# EAGLE design buoy (EAGLE 7.7.0)
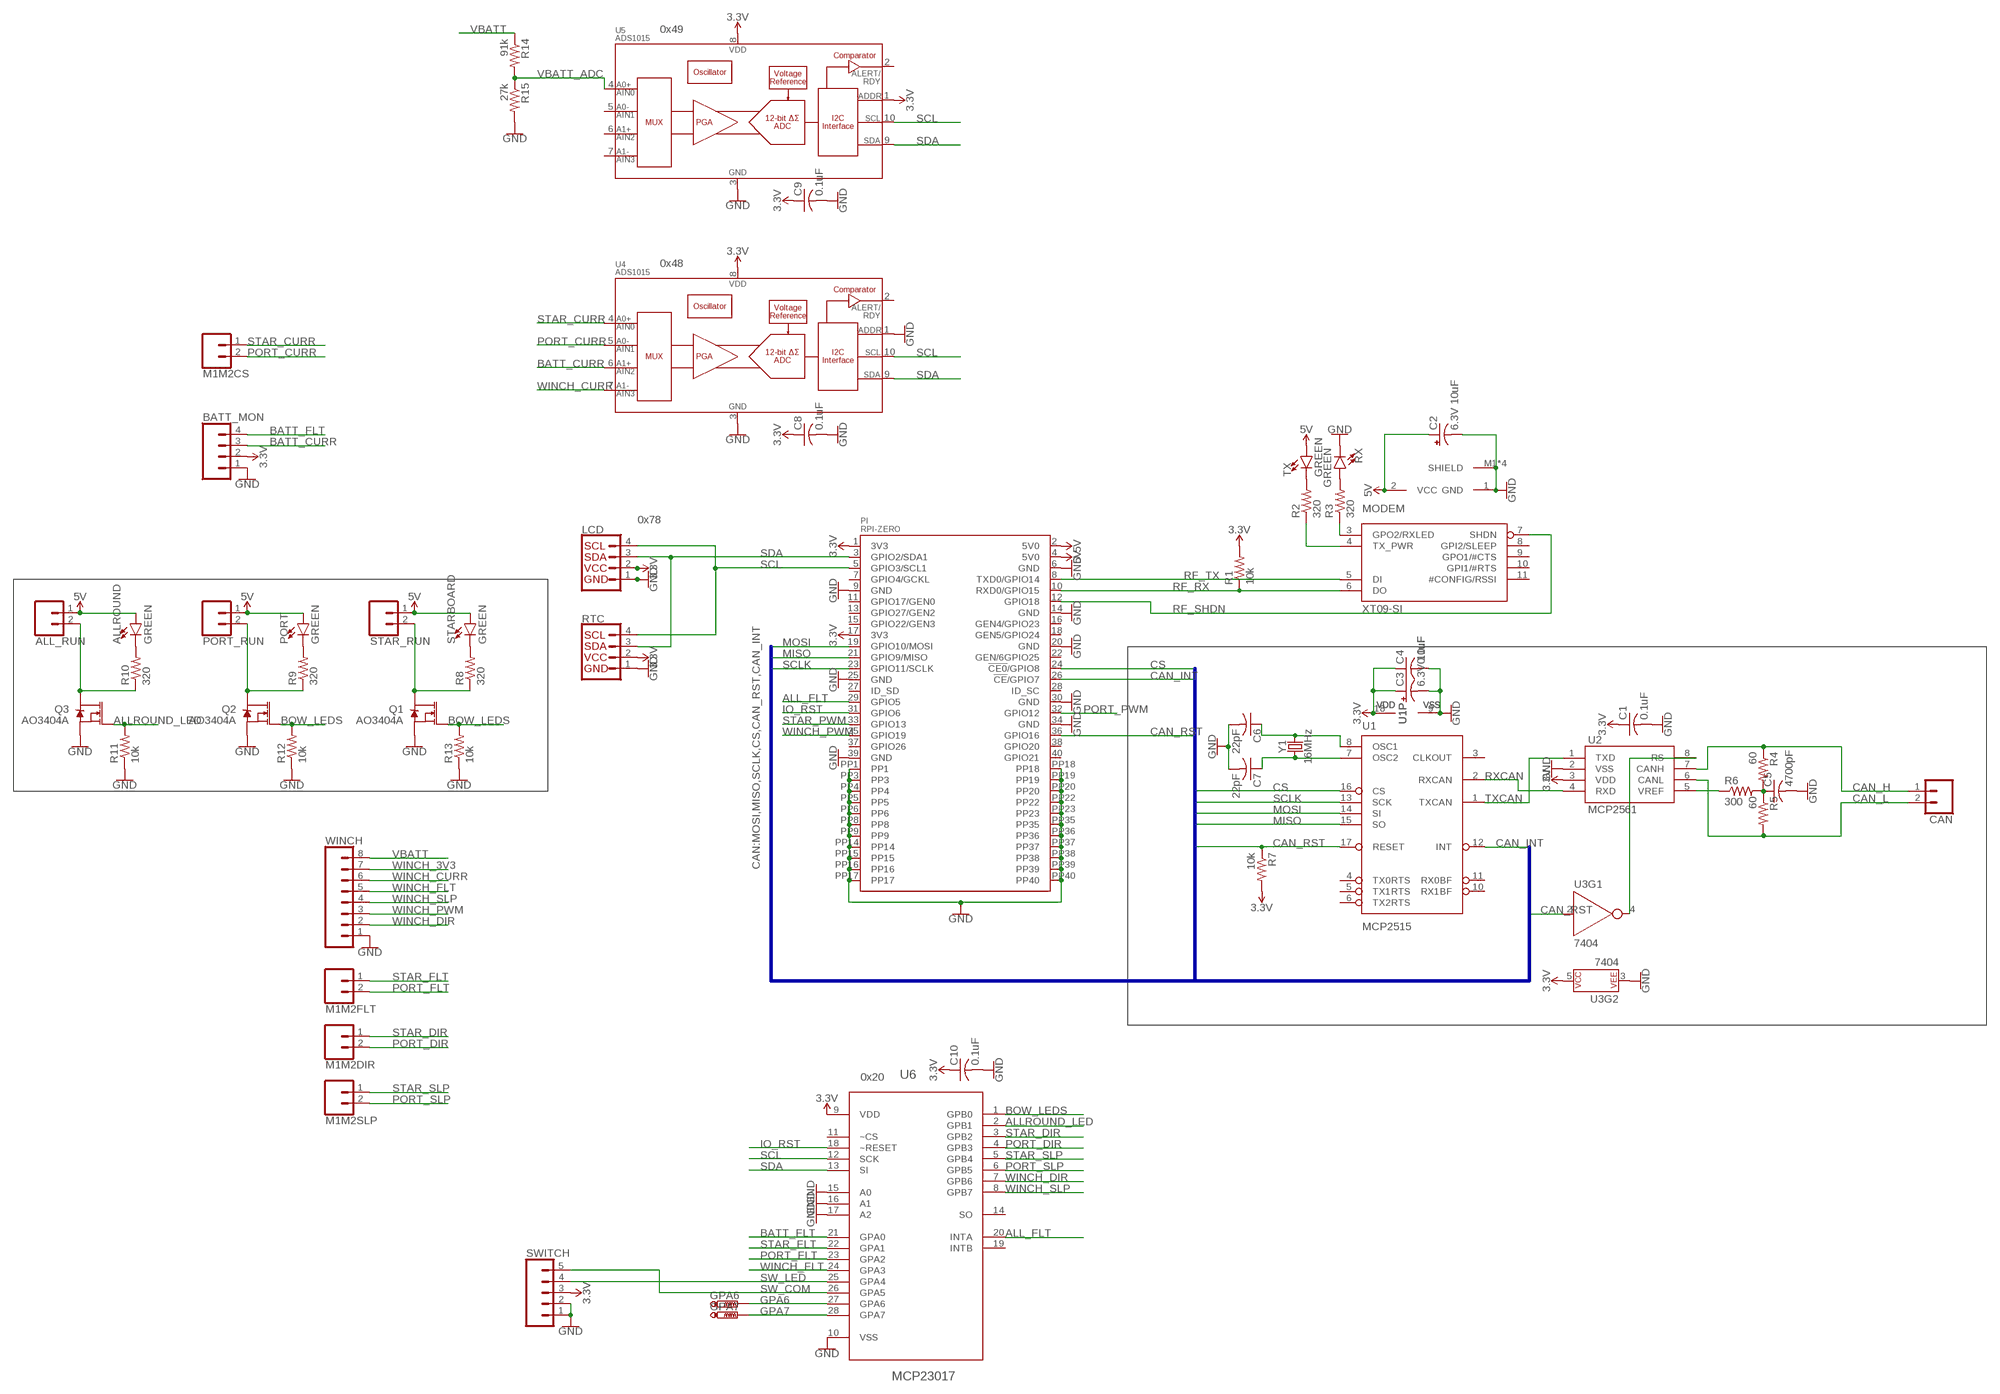
[diagram p0: schematic, sheet 1]

## Parts
ALL_RUN  CONN_02JST-PTH-2  [JST-2-PTH]
ALLROUND  GREEN  LED-GREEN1206  [LED-1206]
BATT_MON  CONN_04LOCK  [1X04_LOCK]
C1  0.1uF  C-USC1206  [C1206]
C2  6.3V 10uF  CPOL-US153CLV-0405  [153CLV-0405]
C3  6.3V 10uF  CPOL-US153CLV-0405  [153CLV-0405]
C4  0.1uF  C-USC1206  [C1206]
C5  4700pF  C-USC1206  [C1206]
C6  22pF  C-USC1206  [C1206]
C7  22pF  C-USC1206  [C1206]
C8  0.1uF  C-USC1206  [C1206]
C9  0.1uF  C-USC1206  [C1206]
C10  0.1uF  C-USC1206  [C1206]
CAN  CONN_02JST-PTH-2  [JST-2-PTH]
GPA6  PTR1B1,27  [B1,27]
GPA7  PTR1B1,27  [B1,27]
LCD  I2C_STANDARD  [1X04]
M1M2CS  CONN_02JST-PTH-2  [JST-2-PTH]
M1M2DIR  CONN_02JST-PTH-2  [JST-2-PTH]
M1M2FLT  CONN_02JST-PTH-2  [JST-2-PTH]
M1M2SLP  CONN_02JST-PTH-2  [JST-2-PTH]
MODEM  XT09-SI  [XT09-SI]
PI  RPI-ZERO  [RASP_PI_ZERO_BOARD_FULL]
PORT  GREEN  LED-GREEN1206  [LED-1206]
PORT_RUN  CONN_02JST-PTH-2  [JST-2-PTH]
Q1  AO3404A  MOSFET-NCH-AO3404A  [SOT23-3]
Q2  AO3404A  MOSFET-NCH-AO3404A  [SOT23-3]
Q3  AO3404A  MOSFET-NCH-AO3404A  [SOT23-3]
R1  10k  R-US_R1206  [R1206]
R2  320  R-US_R1206  [R1206]
R3  320  R-US_R1206  [R1206]
R4  60  R-US_R1206  [R1206]
R5  60  R-US_R1206  [R1206]
R6  300  R-US_R1206  [R1206]
R7  10k  R-US_R1206  [R1206]
R8  320  R-US_R1206  [R1206]
R9  320  R-US_R1206  [R1206]
R10  320  R-US_R1206  [R1206]
R11  10k  R-US_R1206  [R1206]
R12  10k  R-US_R1206  [R1206]
R13  10k  R-US_R1206  [R1206]
R14  91k  R-US_R1206  [R1206]
R15  27k  R-US_R1206  [R1206]
RTC  I2C_STANDARD  [1X04]
RX  GREEN  LED-GREEN1206  [LED-1206]
STAR_RUN  CONN_02JST-PTH-2  [JST-2-PTH]
STARBOARD  GREEN  LED-GREEN1206  [LED-1206]
SWITCH  CONN_05LOCK  [1X05_LOCK]
TX  GREEN  LED-GREEN1206  [LED-1206]
U1  MCP2515  MCP2515(MCP2510)SO  [SO18W]
U2  MCP2561  MCP2551  [SO08]
U3  7404  74LVC1G04SE  [SOT353]
U4  ADS1015  [MSOP10]
U5  ADS1015  [MSOP10]
U6  MCP23017  MCP23S17-E/SO  [SOIC127P030X265-28N]
WINCH  CONN_08LOCK  [1X08_LOCK]
Y1  16MHz  CRYSTAL-16MHZPTH-HC49US  [HC49US]

## Nets
3.3V: BATT_MON.2 C1.1 C3.+ C4.1 C8.1 C9.1 C10.1 LCD.2 PI.1(3V3) PI.17(3V3) R1.2 R7.2 RTC.2 SWITCH.3 U1.18(VDD) U2.3(VDD) U3.5(P$V+) U4.8(VDD) U5.1(ADDR) U5.8(VDD) U6.9(VDD)
5V: ALL_RUN.1 ALLROUND.A C2.+ MODEM.2(VCC) PI.2(5V0) PI.4(5V0) PORT.A PORT_RUN.1 STAR_RUN.1 STARBOARD.A TX.A
#CAN_RST: U2.8(RS) U3.4(Y)
ALL_FLT: PI.29(GPIO5) U6.20(INTA)
ALLROUND_IND: ALLROUND.C R10.2
ALLROUND_LED: Q3.1(G) R11.2 U6.2(GPB1)
ALLROUND_LED_LSD: ALL_RUN.2 Q3.3(D) R10.1
BATT_CURR: BATT_MON.3 U4.6(AIN2)
BATT_FLT: BATT_MON.4 U6.21(GPA0)
BOW_LEDS: Q1.1(G) Q2.1(G) R12.2 R13.2 U6.1(GPB0)
CAN_H: CAN.1 R4.1 U2.7(CANH)
CAN_INT: PI.26(!CE!/GPIO7) U1.12(INT)
CAN_L: CAN.2 R5.2 U2.6(CANL)
CAN_RST: PI.36(GPIO16) R7.1 U1.17(RESET) U3.2(A)
CAN_TERM: C5.1 R4.2 R5.1 R6.2
CAN_VREF: R6.1 U2.5(VREF)
CS: PI.24(!CE0!/GPIO8) U1.16(CS)
GND: BATT_MON.1 C1.2 C2.- C3.- C4.2 C5.2 C6.2 C7.2 C8.2 C9.2 C10.2 LCD.1 MODEM.1(GND) MODEM.M1(SHIELD) MODEM.M2(SHIELD) MODEM.M3(SHIELD) MODEM.M4(SHIELD) PI.6(GND) PI.9(GND) PI.14(GND) PI.20(GND) PI.25(GND) PI.30(GND) PI.34(GND) PI.39(GND) PI.PP1 PI.PP3 PI.PP4 PI.PP5 PI.PP6 PI.PP8 PI.PP9 PI.PP14 PI.PP15 PI.PP16 PI.PP17 PI.PP18 PI.PP19 PI.PP20 PI.PP22 PI.PP23 PI.PP35 PI.PP36 PI.PP37 PI.PP38 PI.PP39 PI.PP40 Q1.2(S) Q2.2(S) Q3.2(S) R11.1 R12.1 R13.1 R15.2 RTC.1 RX.C SWITCH.1 SWITCH.2 U1.9(VSS) U2.2(VSS) U3.3(P$V-) U4.1(ADDR) U4.3(VSS) U5.3(VSS) U6.10(VSS) U6.15(A0) U6.16(A1) U6.17(A2) WINCH.1
GPA6: GPA6.TP U6.27(GPA6)
GPA7: GPA7.TP U6.28(GPA7)
IO_RST: PI.31(GPIO6) U6.18(~RESET)
MISO: PI.21(GPIO9/MISO) U1.15(SO)
MOSI: PI.19(GPIO10/MOSI) U1.14(SI)
OSC1: C6.1 U1.8(OSC1) Y1.2
OSC2: C7.1 U1.7(OSC2) Y1.1
PORT_CURR: M1M2CS.2 U4.5(AIN1)
PORT_DIR: M1M2DIR.2 U6.4(GPB3)
PORT_FLT: M1M2FLT.2 U6.23(GPA2)
PORT_IND: PORT.C R9.2
PORT_LED_LSD: PORT_RUN.2 Q2.3(D) R9.1
PORT_PWM: PI.32(GPIO12)
PORT_SLP: M1M2SLP.2 U6.6(GPB5)
RF_RX: MODEM.6(DO) PI.10(RXD0/GPIO15) R1.1
RF_SHDN: MODEM.7(SHDN) PI.12(GPIO18)
RF_TX: MODEM.5(DI) PI.8(TXD0/GPIO14)
RXCAN: U1.2(RXCAN) U2.4(RXD)
RXLED: MODEM.3(GPO2/RXLED) R3.1
RXLED_L: R3.2 RX.A
SCL: LCD.4 PI.5(GPIO3/SCL1) RTC.4 U4.10(SCL) U5.10(SCL) U6.12(SCK)
SCLK: PI.23(GPIO11/SCLK) U1.13(SCK)
SDA: LCD.3 PI.3(GPIO2/SDA1) RTC.3 U4.9(SDA) U5.9(SDA) U6.13(SI)
STAR_CURR: M1M2CS.1 U4.4(AIN0)
STAR_DIR: M1M2DIR.1 U6.3(GPB2)
STAR_FLT: M1M2FLT.1 U6.22(GPA1)
STAR_IND: R8.2 STARBOARD.C
STAR_PWM: PI.33(GPIO13)
STAR_SLP: M1M2SLP.1 U6.5(GPB4)
STARBOARD_LED_LSD: Q1.3(D) R8.1 STAR_RUN.2
SW_COM: SWITCH.5 U6.26(GPA5)
SW_LED: SWITCH.4 U6.25(GPA4)
TX_PWR: MODEM.4(TX_PWR) R2.1
TX_PWR_L: R2.2 TX.C
TXCAN: U1.1(TXCAN) U2.1(TXD)
VBATT: R14.1 WINCH.8
VBATT_ADC: R14.2 R15.1 U5.4(AIN0)
WINCH_3V3: WINCH.7
WINCH_CURR: U4.7(AIN3) WINCH.6
WINCH_DIR: U6.7(GPB6) WINCH.2
WINCH_FLT: U6.24(GPA3) WINCH.5
WINCH_PWM: PI.35(GPIO19) WINCH.3
WINCH_SLP: U6.8(GPB7) WINCH.4
Unconnected: MODEM.8(GPI2/SLEEP) MODEM.9(GPO1/#CTS) MODEM.10(GPI1/#RTS) MODEM.11(#CONFIG/RSSI) PI.7(GPIO4/GCKL) PI.11(GPIO17/GEN0) PI.13(GPIO27/GEN2) PI.15(GPIO22/GEN3) PI.16(GEN4/GPIO23) PI.18(GEN5/GPIO24) PI.22(GEN/6GPIO25) PI.27(ID_SD) PI.28(ID_SC) PI.37(GPIO26) PI.38(GPIO20) PI.40(GPIO21) U1.3(CLKOUT) U1.4(TX0RTS) U1.5(TX1RTS) U1.6(TX2RTS) U1.10(RX1BF) U1.11(RX0BF) U4.2(ALERT/RDY) U5.2(ALERT/RDY) U5.5(AIN1) U5.6(AIN2) U5.7(AIN3) U6.11(~CS) U6.14(SO) U6.19(INTB)

## Buses
CAN:MOSI,MISO,SCLK,CS,CAN_RST,CAN_INT

## Notes on the sheet
- 0x49
- 0x48
- 0x78
- 0x20

## Library data of the parts
ALL_RUN CAN M1M2CS M1M2DIR M1M2FLT M1M2SLP PORT_RUN STAR_RUN = SparkFun-Connectors:CONN_02: Multi connection point. Often used as Generic Header-pin footprint for 0.1 inch spaced/style header connections On any of the 0.1 inch spaced packages, you can populate with these: Break Away Headers - Straight <https://www.sparkfun.com/products/116> (PRT-00116) Break Away Male Headers - Right Angle <https://www.sparkfun.com/products/553> (PRT-00553) Female Headers <https://www.sparkfun.com/products/115> (PRT-00115) Break Away Headers - Machine Pin <https://www.sparkfun.com/products/117> (PRT-00117) Break Away Female Headers - Swiss Machine Pin <https://www.sparkfun.com/products/743> (PRT-00743) For SCREWTERMINALS and SPRING TERMINALS visit here: Screw Terimnals on SparkFun.com <https://www.sparkfun.com/search/results?term=Screw+Terminals> (5mm/3.5mm/2.54mm spacing) This device is also useful as a general connection point to wire up your design to another part of your project. Our various solder wires solder well into these plated through hole pads. Hook-Up Wire - Assortment (Stranded, 22 AWG) <https://www.sparkfun.com/products/11375> (PRT-11375) Hook-Up Wire - Assortment (Solid Core, 22 AWG) <https://www.sparkfun.com/products/11367> (PRT-11367) View the entire wire category on our website here <https://www.sparkfun.com/categories/141> Special notes: Molex polarized connector foot print use with: PRT-08233 with associated crimp pins and housings. 2.54_SCREWTERM for use with PRT-10571. 3.5mm Screw Terminal footprints for PRT-08084 5mm Screw Terminal footprints for use with PRT-08432; PROD_ID: CONN-09863; SKU: PRT-09914
ALLROUND PORT RX STARBOARD TX = SparkFun-LED:LED-GREEN: Green SMD LED Used in manufacturing of various products at SparkFun Packages: 0603 - SMD 0603 package [Product Link] <http://www.futureelectronics.com/en/technologies/semiconductors/optoelectronics/leds/Pages/9894312-LTST-C190GKT.aspx?CrossPart=HSMG-C190&IM=0> LilyPad 1206 - SMD1206 LilyPad package [Product Link] <http://www.futureelectronics.com/en/Technologies/Product.aspx?ProductID=IN150NGHARVATEKCORPORATION2049943&IM=0> 1206 - SMD1206 package [Product Link] <http://www.futureelectronics.com/en/technologies/semiconductors/optoelectronics/leds/Pages/8315665-LTST-C150KGKT.aspx?IM=0> 1206 Bottom Mount -SMD 1206 Bottom Mount [Product Link] <http://www.digikey.com/product-detail/en/lite-on-inc/LTST-C230KGKT/160-1456-1-ND/386854> SparkFun Products: Pro Mini 328 -5V <https://www.sparkfun.com/products/821> RedBoard <https://www.sparkfun.com/products/12757> MP3 Trigger <https://www.sparkfun.com/products/13720> Makey Makey <https://www.sparkfun.com/products/11076>; PROD_ID: DIO-00862
BATT_MON = SparkFun-Connectors:CONN_04: Multi connection point. Often used as Generic Header-pin footprint for 0.1 inch spaced/style header connections On any of the 0.1 inch spaced packages, you can populate with these: Break Away Headers - Straight <https://www.sparkfun.com/products/116> (PRT-00116) Break Away Male Headers - Right Angle <https://www.sparkfun.com/products/553> (PRT-00553) Female Headers <https://www.sparkfun.com/products/115> (PRT-00115) Break Away Headers - Machine Pin <https://www.sparkfun.com/products/117> (PRT-00117) Break Away Female Headers - Swiss Machine Pin <https://www.sparkfun.com/products/743> (PRT-00743) For SCREWTERMINALS and SPRING TERMINALS visit here: Screw Terimnals on SparkFun.com <https://www.sparkfun.com/search/results?term=Screw+Terminals> (5mm/3.5mm/2.54mm spacing) This device is also useful as a general connection point to wire up your design to another part of your project. Our various solder wires solder well into these plated through hole pads. Hook-Up Wire - Assortment (Stranded, 22 AWG) <https://www.sparkfun.com/products/11375> (PRT-11375) Hook-Up Wire - Assortment (Solid Core, 22 AWG) <https://www.sparkfun.com/products/11367> (PRT-11367) View the entire wire category on our website here <https://www.sparkfun.com/categories/141> Special notes: Molex polarized connector foot print use with SKU : PRT-08231 with associated crimp pins and housings. 1MM SMD Version SKU: PRT-10208; PROD_ID: CONN-09696
C1 C4-C10 = rcl:C-US: CAPACITOR, American symbol
C2 C3 = rcl:CPOL-US: POLARIZED CAPACITOR, American symbol
GPA6 GPA7 = testpad:PTR1: TEST PIN
LCD RTC = SparkFun-Connectors:I2C_STANDARD: SparkFun I2C Standard Pinout Header SparkFun has standardized on a pinout for all I2C based sensor breakouts. This pinout allows I2C boards to be plugged directly into the headers on Arduino Uno compatible boards, and to be daisy chained easily. Example SparkFun Products: SparkFun Atmospheric Sensor Breakout - BME280 <https://www.sparkfun.com/products/13676> SparkFun Altitude/Pressure Sensor Breakout - MPL3115A2 <https://www.sparkfun.com/products/11084> SparkFun TOF Range Finder Sensor - VL6180 <https://www.sparkfun.com/products/12785>
MODEM = autobuoy:XT09-SI: Digi MaxStream 9XTend 900MHz OEM Module XT09-SI, with low-profile SMT header
PI = rpi-zero:RPI-ZERO
Q1-Q3 = SparkFun-DiscreteSemi:MOSFET-NCH: N-channel MOSFETs Voltage controlled devices that allow control of high current outputs. SparkFun Products: SparkFun OpenScale <https://www.sparkfun.com/products/13261> SparkFun Digital Sandbox <https://www.sparkfun.com/products/12651> SparkFun Monster Moto Shield <https://www.sparkfun.com/products/10182> SparkFun MOSFET Power Controller <https://www.sparkfun.com/products/11214>; PROD_ID: TRANS-12988; VALUE: 5.8A/30V/35mΩ
R1-R15 = rcl:R-US_: RESISTOR, American symbol
SWITCH = SparkFun-Connectors:CONN_05: Multi connection point. Often used as Generic Header-pin footprint for 0.1 inch spaced/style header connections On any of the 0.1 inch spaced packages, you can populate with these: Break Away Headers - Straight <https://www.sparkfun.com/products/116> (PRT-00116) Break Away Male Headers - Right Angle <https://www.sparkfun.com/products/553> (PRT-00553) Female Headers <https://www.sparkfun.com/products/115> (PRT-00115) Break Away Headers - Machine Pin <https://www.sparkfun.com/products/117> (PRT-00117) Break Away Female Headers - Swiss Machine Pin <https://www.sparkfun.com/products/743> (PRT-00743) For SCREWTERMINALS and SPRING TERMINALS visit here: Screw Terimnals on SparkFun.com <https://www.sparkfun.com/search/results?term=Screw+Terminals> (5mm/3.5mm/2.54mm spacing) This device is also useful as a general connection point to wire up your design to another part of your project. Our various solder wires solder well into these plated through hole pads. Hook-Up Wire - Assortment (Stranded, 22 AWG) <https://www.sparkfun.com/products/11375> (PRT-11375) Hook-Up Wire - Assortment (Solid Core, 22 AWG) <https://www.sparkfun.com/products/11367> (PRT-11367) View the entire wire category on our website here <https://www.sparkfun.com/categories/141> Special notes: Molex polarized connector foot print use with SKU : PRT-08231 with associated crimp pins and housings. 1MM SMD Version SKU: PRT-10208
U1 = SparkFun-IC-Comms:MCP2515(MCP2510): CAN controller with SPI interface The MCP2515 controller supercedes the MCP2510 while addressing all errata associated with it. The two devices are pin compatible, either can be used with this device. 18-pin package SOIC Simple SPI interface to any MCU. One-shot mode ensures message transmission is attempted only once Databyte filtering Start-of-Frame (SOF) output Low-power CMOS Technology Datasheet <http://www.sparkfun.com/datasheets/DevTools/Arduino/MCP2515.pdf> SparkFun Products CAN-BUS Shield <https://www.sparkfun.com/products/13262> (DEV-13262); PROD_ID: IC-09906
U2 = SparkFun-IC-Comms:MCP2551: MCP2551 High Speed CAN Transceiver High speed CAN transceiver Datasheet <http://www.sparkfun.com/datasheets/DevTools/Arduino/MCP2551.pdf> SparkFun Products CAN-BUS Shield <https://www.sparkfun.com/products/13262> (DEV-13262) SparkFun OBD-II UART <https://www.sparkfun.com/products/9555> (WIG-09555); PROD_ID: IC-09907; VALUE: MCP2551
U3 = SparkFun-IC-Logic:74*1G04: Single Inverter IC NOT GATE INVERTER SNGL 1IN SOT353 Supply: 1.65V to 5.5V Datasheet <http://diodes.com/datasheets/74LVC1G04.pdf> SparkFun Products SparkFun Stepoko <https://www.sparkfun.com/products/13899> (ROB-13899) SparkFun CryptoShield <https://www.sparkfun.com/products/13183> (DEV-13183) SparkFun LogicBlocks Kit <https://www.sparkfun.com/products/11006> (KIT-11006) SparkFun ArduMoto <https://www.sparkfun.com/products/9815> (DEV-09815); PROD_ID: IC-10843; VALUE: 74LVC1G04SE
U4 U5 = SparkFun-IC-Conversion:ADS1015: ADS1015 12-BIT ADC 12-Bit Del-Sig ADC Four single-ended inputs or two differential inputs Internal PGA I2C interface 2.0-5.5V SparkFun Products SparkFun Block for Intel Edison - ADC <https://www.sparkfun.com/products/13770> (DEV-13770); PROD_ID: IC-12270
U6 = Microchip_By_element14_Batch_1:MCP23S17-E/SO: 16-Bit I/O Expander; DESCRIPTION: IC I/O EXPANDER; MPN: MCP23S17-E/SO; OC_FARNELL: 1332093; OC_NEWARK: 31K2950; PACKAGE: SOIC-28; SUPPLIER: Microchip
WINCH = SparkFun-Connectors:CONN_08: Multi connection point. Often used as Generic Header-pin footprint for 0.1 inch spaced/style header connections On any of the 0.1 inch spaced packages, you can populate with these: Break Away Headers - Straight <https://www.sparkfun.com/products/116> (PRT-00116) Break Away Male Headers - Right Angle <https://www.sparkfun.com/products/553> (PRT-00553) Female Headers <https://www.sparkfun.com/products/115> (PRT-00115) Break Away Headers - Machine Pin <https://www.sparkfun.com/products/117> (PRT-00117) Break Away Female Headers - Swiss Machine Pin <https://www.sparkfun.com/products/743> (PRT-00743) Arduino Stackable Header - 8 Pin <https://www.sparkfun.com/products/9279> (PRT-09279) For SCREWTERMINALS and SPRING TERMINALS visit here: Screw Terimnals on SparkFun.com <https://www.sparkfun.com/search/results?term=Screw+Terminals> (5mm/3.5mm/2.54mm spacing) This device is also useful as a general connection point to wire up your design to another part of your project. Our various solder wires solder well into these plated through hole pads. Hook-Up Wire - Assortment (Stranded, 22 AWG) <https://www.sparkfun.com/products/11375> (PRT-11375) Hook-Up Wire - Assortment (Solid Core, 22 AWG) <https://www.sparkfun.com/products/11367> (PRT-11367) View the entire wire category on our website here <https://www.sparkfun.com/categories/141> Special notes: Molex polarized connector foot print use with SKU : PRT-08231 with associated crimp pins and housings. 1MM SMD Version SKU: PRT-10208 NOTES ON THE VARIANTS LOCK and LOCK_LONGPADS... This footprint was designed to help hold the alignment of a through-hole component (i.e. 6-pin header) while soldering it into place. You may notice that each hole has been shifted either up or down by 0.005 of an inch from it's more standard position (which is a perfectly straight line). This slight alteration caused the pins (the squares in the middle) to touch the edges of the holes. Because they are alternating, it causes a "brace" to hold the component in place. 0.005 has proven to be the perfect amount of "off-center" position when using our standard breakaway headers. Although looks a little odd when you look at the bare footprint, once you have a header in there, the alteration is very hard to notice. Also,if you push a header all the way into place, it is covered up entirely on the bottom side.
Y1 = SparkFun-Clocks:CRYSTAL-16MHZ: 16MHz Crystal Digikey Example <http://www.digikey.com/product-search/en?keywords=535-9122-1-ND> Frequency: 16MHz Frequency Stability: ±50ppm Frequency Tolerance: ±20ppm Load Capacitance: 18pF SparkFun Products: Pro Micro -5V/16MHz <https://www.sparkfun.com/products/12640> SparkFun Serial Enabled LCD Kit <https://www.sparkfun.com/products/10097>; PROD_ID: XTAL-08181; SF_ID: COM-00536

## Board
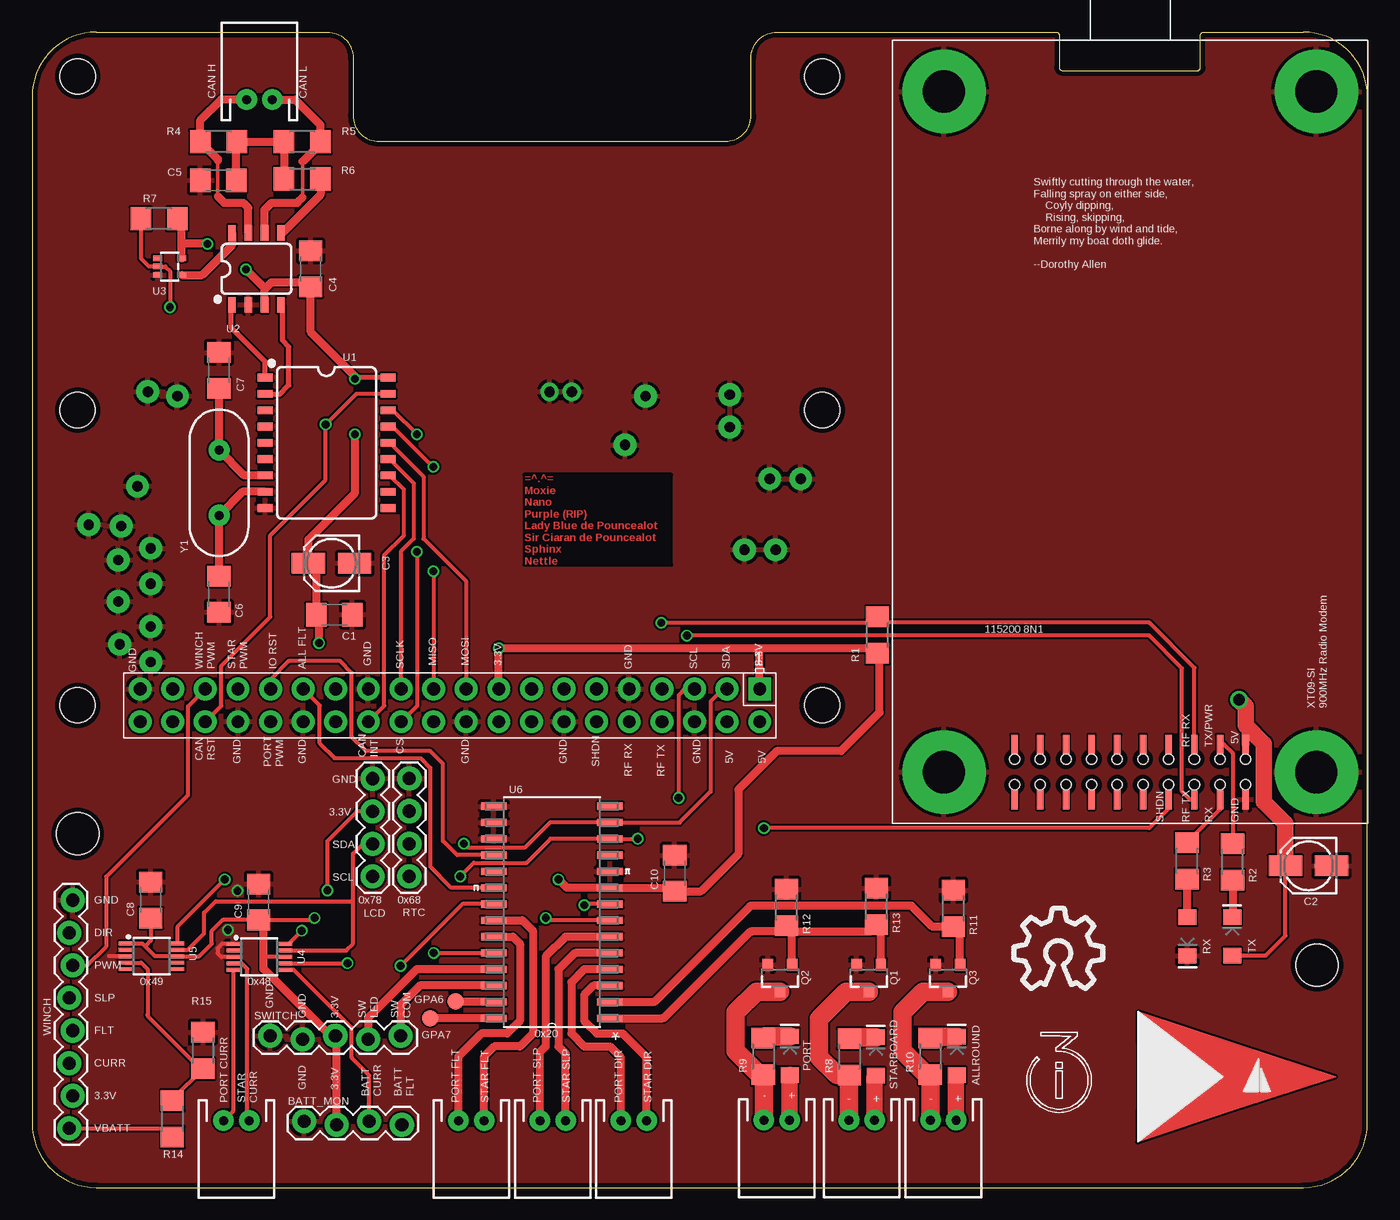
[diagram p1: board, top side]
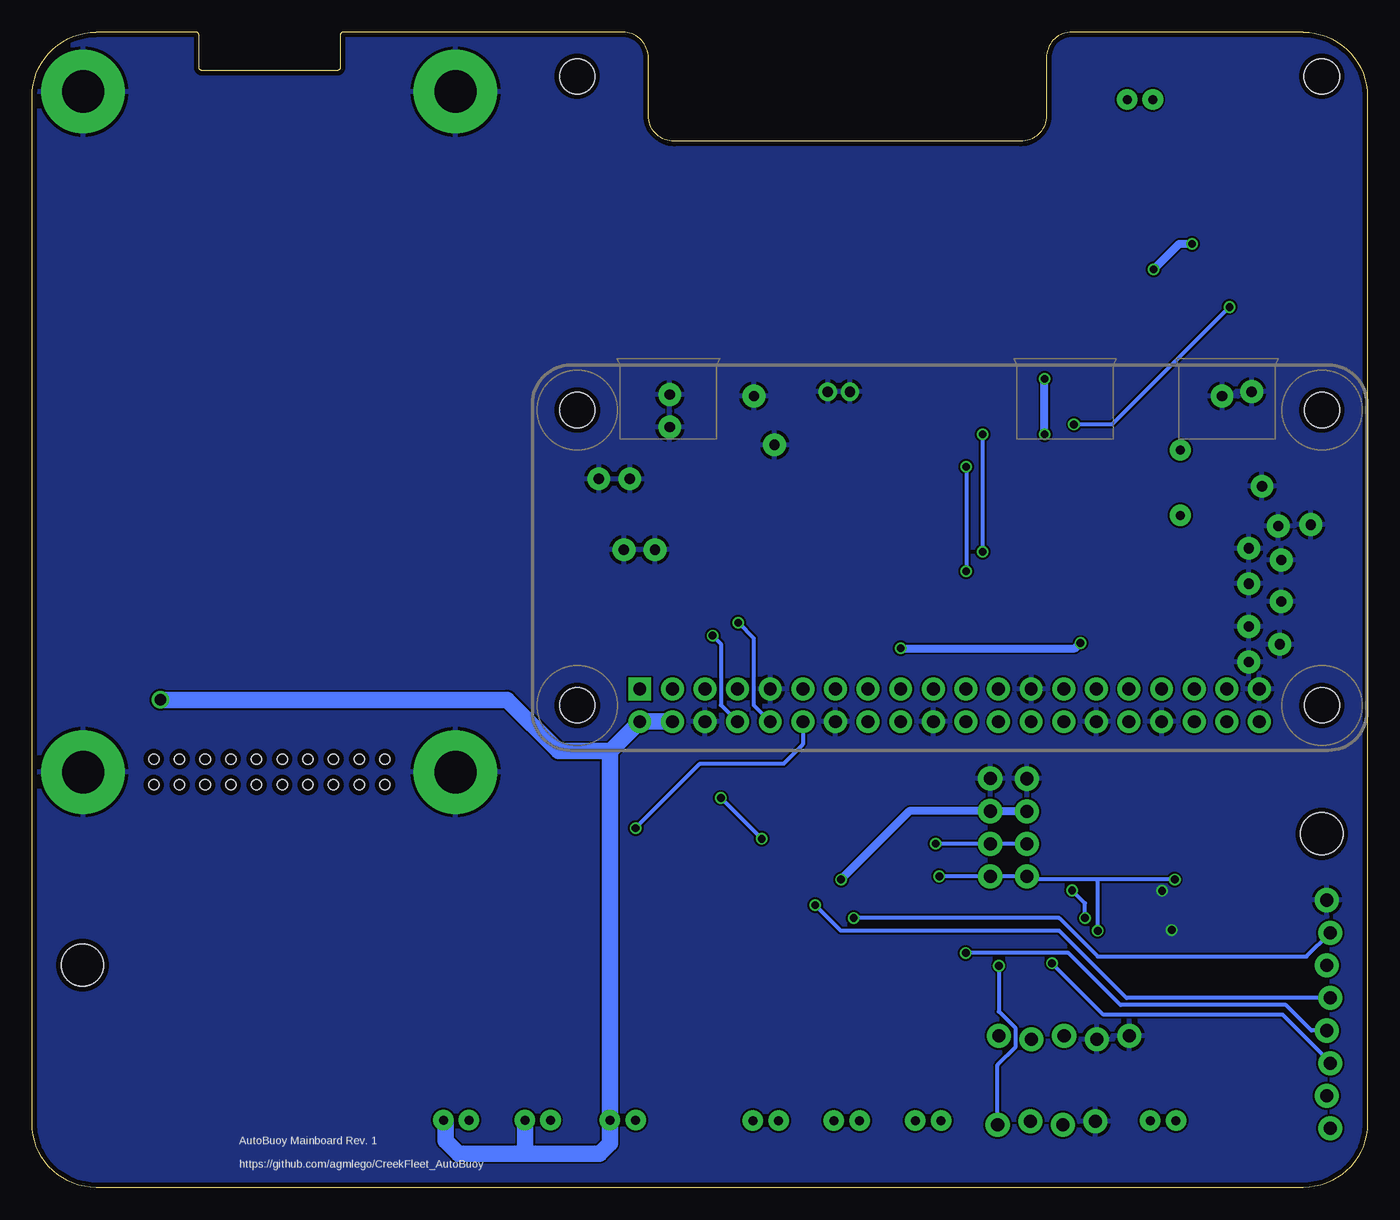
[diagram p2: board, bottom side, seen from below]

Size 104 x 90 mm. Coordinates in mm from the lower left corner, seen from the top.
Outline: 0,85 0,5 arc90 5,0 99,0 arc90 104,5 104,85 arc90 99,90 91.25,90 arc90 91,89.75 91,87.25 arc-90 90.75,87 80.25,87 arc-90 80,87.25 80,89.75 arc90 79.75,90 58,90 arc90 56,88 56,83.5 arc-90 54,81.5 27,81.5 arc-90 25,83.5 25,88 arc90 23,90 5,90 arc90 0,85
Copper layers (1*16): Top 0.035559375mm / dielectric 1.6mm / Bottom 0.035559375mm
Design rules "oshpark-2layer *": minimum track width 6mil, minimum drill 10mil, track to track 6mil, track to pad 6mil, pad to pad 6mil, via to via 6mil, smd to smd 6mil, copper to edge 15mil, drill to drill 6mil, minimum pad ring 5mil, minimum via ring 5mil, stop-mask expansion 2.5mil, vias tented up to drill 0mil, thermal gap 10mil
Holes 2.75 mm at 3.55,86.55 61.55,86.55
Holes 3.3 mm at 3.56,27.56 100.08,17.32

### Footprints (pad centres in the part's own frame; a part is rotated, then mirrored left to right if it is on the bottom)
JST-2-PTH = drill 0.7 pad 1.6: 1 -1,0; 2 1,0
LED-1206 = smd 1.2 x 1.4: A -1.5,0; C 1.5,0
1X04_LOCK = drill 1.016 pad 1.88: 1 0,0.127; 2 2.54,-0.127; 3 5.08,0.127; 4 7.62,-0.127
C1206 = smd 1.6 x 1.8: 1 -1.4,0; 2 1.4,0
153CLV-0405 = smd 2.6 x 1.6: + 1.8,0; - -1.8,0
B1,27 = smd 1.27 x 1.27: TP 0,0
1X04 = drill 1.016 pad 1.88: 1 0,0; 2 2.54,0; 3 5.08,0; 4 7.62,0
XT09-SI = smd 1.5 x 0.5: 1 1.85,9.5; 2 6.15,9.5; 3 1.85,11.5; 4 6.15,11.5; 5 1.85,13.5; 6 6.15,13.5; 7 1.85,15.5; 8 6.15,15.5; 9 1.85,17.5; 10 6.15,17.5; 11 1.85,19.5; 12 6.15,19.5; 13 1.85,21.5; 14 6.15,21.5; 15 1.85,23.5; 16 6.15,23.5; 17 1.85,25.5; 18 6.15,25.5; 19 1.85,27.5; 20 6.15,27.5 | drill 3.3 pad 6.5: M1 4,33; M2 4,4; M3 57,33; M4 57,4 | hole 0.8: 3,9.5; 5,9.5; 3,11.5; 5,11.5; 3,13.5; 5,13.5; 3,15.5; 5,15.5; 3,17.5; 5,17.5; 3,19.5; 5,19.5; 3,21.5; 5,21.5; 3,23.5; 5,23.5; 3,25.5; 5,25.5; 3,27.5; 5,27.5
RASP_PI_ZERO_BOARD_FULL = drill 1 pad 1.778 square: 1 8.37,25.23 | drill 1 pad 1.778: 2 8.37,27.77; 3 10.91,25.23; 4 10.91,27.77; 5 13.45,25.23; 6 13.45,27.77; 7 15.99,25.23; 8 15.99,27.77; 9 18.53,25.23; 10 18.53,27.77; 11 21.07,25.23; 12 21.07,27.77; 13 23.61,25.23; 14 23.61,27.77; 15 26.15,25.23; 16 26.15,27.77; 17 28.69,25.23; 18 28.69,27.77; 19 31.23,25.23; 20 31.23,27.77; 21 33.77,25.23; 22 33.77,27.77; 23 36.31,25.23; 24 36.31,27.77; 25 38.85,25.23; 26 38.85,27.77; 27 41.39,25.23; 28 41.39,27.77; 29 43.93,25.23; 30 43.93,27.77; 31 46.47,25.23; 32 46.47,27.77; 33 49.01,25.23; 34 49.01,27.77; 35 51.55,25.23; 36 51.55,27.77; 37 54.09,25.23; 38 54.09,27.77; 39 56.63,25.23; 40 56.63,27.77 | drill 0.8 pad 1.778: PP1 10.699,4.832; PP3 7.593,8.858; PP4 7.133,14.38; PP5 55.796,23.124; PP6 10.699,2.301; PP8 5.177,8.858; PP9 9.549,14.38; PP14 58.327,18.407; PP15 55.796,14.265; PP16 55.796,20.363; PP17 58.212,21.743; PP18 55.796,17.027; PP19 58.327,15.186; PP20 56.832,9.434; PP35 17.257,2.416; PP36 60.628,12.425; PP37 56.026,2.071; PP38 53.726,2.416; PP39 58.097,12.54; PP40 18.867,6.212 | drill 0.8 pad 1.422: PP22 23.009,2.071; PP23 24.734,2.071 | hole 2.75: 3.5,3.5; 3.5,26.5; 61.5,3.5; 61.5,26.5
SOT23-3 = smd 0.8 x 0.9: 1 -0.95,-1; 2 0.95,-1; 3 0,1.1
R1206 = smd 1.6 x 1.803: 1 -1.422,0; 2 1.422,0
1X05_LOCK = drill 1.016 pad 1.88: 1 0,0.127; 2 2.54,-0.127; 3 5.08,0.127; 4 7.62,-0.127; 5 10.16,0.127
SO18W = smd 0.6 x 1.2: 1 -5.08,-4.788; 2 -3.81,-4.788; 3 -2.54,-4.788; 4 -1.27,-4.788; 5 0,-4.788; 6 1.27,-4.788; 7 2.54,-4.788; 8 3.81,-4.788; 9 5.08,-4.788; 10 5.08,4.788; 11 3.81,4.788; 12 2.54,4.788; 13 1.27,4.788; 14 0,4.788; 15 -1.27,4.788; 16 -2.54,4.788; 17 -3.81,4.788; 18 -5.08,4.788
SO08 = smd 0.6 x 1.2: 1 -1.905,-2.8; 2 -0.635,-2.8; 3 0.635,-2.8; 4 1.905,-2.8; 5 1.905,2.8; 6 0.635,2.8; 7 -0.635,2.8; 8 -1.905,2.8
SOT353 = smd 0.42 x 0.7: 1 -0.65,-0.95; 2 0,-0.95; 3 0.65,-0.95; 4 0.65,0.95; 5 -0.65,0.95
MSOP10 = smd 0.3 x 1: 1 -1,-2.05; 2 -0.5,-2.05; 3 0,-2.05; 4 0.5,-2.05; 5 1,-2.05; 6 1,2.05; 7 0.5,2.05; 8 0,2.05; 9 -0.5,2.05; 10 -1,2.05
SOIC127P030X265-28N = smd 1.981 x 0.559: 1 -4.521,8.255; 2 -4.521,6.985; 3 -4.521,5.715; 4 -4.521,4.445; 5 -4.521,3.175; 6 -4.521,1.905; 7 -4.521,0.635; 8 -4.521,-0.635; 9 -4.521,-1.905; 10 -4.521,-3.175; 11 -4.521,-4.445; 12 -4.521,-5.715; 13 -4.521,-6.985; 14 -4.521,-8.255; 15 4.521,-8.255; 16 4.521,-6.985; 17 4.521,-5.715; 18 4.521,-4.445; 19 4.521,-3.175; 20 4.521,-1.905; 21 4.521,-0.635; 22 4.521,0.635; 23 4.521,1.905; 24 4.521,3.175; 25 4.521,4.445; 26 4.521,5.715; 27 4.521,6.985; 28 4.521,8.255
1X08_LOCK = drill 1.016 pad 1.88: 1 0,0.127; 2 2.54,-0.127; 3 5.08,0.127; 4 7.62,-0.127; 5 10.16,0.127; 6 12.7,-0.127; 7 15.24,0.127; 8 17.78,-0.127
HC49US = drill 0.7 pad 1.651: 1 -2.54,0; 2 2.54,0

### Placement (x,y rotation side)
ALL_RUN  70.97,5.26 180 top
ALLROUND  72.02,10.26 90 top
BATT_MON  21.18,5.03 0 top
C1  23.54,44.62 0 top
C2  99.42,25.07 180 top
C3  23.32,48.63 180 top
C4  21.7,71.56 90 top
C5  14.51,78.45 180 top
C6  14.55,46.22 270 top
C7  14.55,63.65 90 top
C8  9.24,22.4 90 top
C9  17.64,22.25 90 top
C10  50.05,24.49 90 top
CAN  17.71,84.74 0 top
GPA6  33,14.5 0 top
GPA7  31,13.2 0 top
LCD  26.53,31.85 270 top
M1M2CS  15.91,5.21 180 top
M1M2DIR  46.86,5.21 180 top
M1M2FLT  34.21,5.21 180 top
M1M2SLP  40.56,5.21 180 top
MODEM  104.02,28.37 90 top
PI  65.04,64.06 180 top
PORT  59.02,10.28 90 top
PORT_RUN  58,5.26 180 top
Q1  65.17,16.35 180 top
Q2  58.25,16.35 180 top
Q3  71.33,16.35 180 top
R1  65.85,43.04 270 top
R2  93.5,25.37 270 top
R3  89.95,25.45 270 top
R4  14.53,81.46 0 top
R5  21.05,81.46 0 top
R6  21.05,78.56 180 top
R7  9.89,75.46 0 top
R8  63.65,10.2 90 top
R9  56.95,10.22 90 top
R10  69.95,10.24 90 top
R11  71.75,21.74 270 top
R12  58.75,21.82 270 top
R13  65.75,21.9 270 top
R14  10.92,5.36 90 top
R15  13.31,10.68 90 top
RTC  29.38,31.86 270 top
RX  89.98,19.55 270 top
STAR_RUN  64.62,5.26 180 top
STARBOARD  65.72,10.21 90 top
SWITCH  18.54,11.68 0 top
TX  93.47,19.57 90 top
U1  22.94,58.01 270 top
U2  17.48,71.57 0 top
U3  10.72,71.74 270 top
U4  17.7,17.97 270 top
U5  9.3,18.02 270 top
U6  40.48,21.45 180 top
U$1  [CFLOGO]  86.11,3.56 0 top
U$2  [I3LOGO]  77.47,5.84 0 top
U$3  [OSHWLOGO]  76.45,15.49 0 top
WINCH  3.03,22.39 270 top
Y1  14.56,54.9 270 top

### Tracks (layer width: path | path; a pad name or v marks a point on that pad's centre or on a via)
3.3V  (via drill 0.6)
  Top 0.305: U5.1 8.58,19.02 8.8,18.8 | 8.8,18.8 9.58,18.02 U5.8 13.02,18.02 14,19 14,20 14.85,20.85 C9.1 | C8.1 9.24,19.24 8.8,18.8 | 17.49,21 C9.1 | C9.1 21.85,20.85 v22,21 | v23,23.15 23,27 25.31,29.31 LCD.2 | U4.8 18.1,17.97 18.03,18.03
  Top 0.406: 56.67,41.83 56.5,42 | U1.18 25.24,63.09 v25.15,62.99
  Top 0.61: U2.3 18.11,69.96 | 18.11,69.96 18.66,70.51 21.35,70.51 C4.1 | U3.5 11.67,73.51 | 11.67,73.51 11.67,75.1 R7.2 | 18.11,69.96 18.11,70.05 v16.66,71.51 | v13.66,73.51 11.67,73.51 | PI.17 v36.35,42 56.5,42 65.47,42 R1.2 66,41.47 66,37 63,34 58,34 55,31 55,26 52.09,23.09 C10.1 49.78,23.36 U6.9 41.65,23.36 v41,24 | PI.1 56.67,41.83 | BATT_MON.2 23.72,11.71 SWITCH.3 23.24,11.81 18.03,17.02 18.03,18.03 18.03,20.46 C9.1 | v22.35,42.42 22.35,44.41 C1.1 22.14,48.01 C3.+ 21.52,50.48 25.15,54.1 v25.15,58.67 | 21.66,70.12 C4.1 | 25.24,63.09 21.7,66.64 C4.1
  Bottom 0.305: v22,21 22,22.15 v23,23.15
  Bottom 0.61: v16.66,71.51 14.66,73.51 v13.66,73.51 | v41,24 35.68,29.32 RTC.2 LCD.2 | v36.35,42 22.77,42 v22.35,42.42 | v25.15,58.67 v25.15,62.99
5V  (via drill 0.9)
  Top 0.305: TX.A 96.07,18.07 97.62,19.62 C2.+
  Top 0.61: PI.2 56.71,36.29 | MODEM.2 94.52,36
  Top 1.27: STAR_RUN.1 65.62,8.61 STARBOARD.A | ALL_RUN.1 71.97,8.71 ALLROUND.A | PORT_RUN.1 59,8.76 PORT.A | v94,38 94.52,37.48 94.52,36 95.95,34.57 95.95,30.05 97.62,28.38 C2.+
  Bottom 1.27: PI.4 PI.2 58.96,34 | 65.8,2.65 59.8,2.65 59,3.45 PORT_RUN.1 59,33.96 58.96,34 | 65.8,2.65 70.8,2.65 71.8,3.65 71.8,5.09 ALL_RUN.1 | STAR_RUN.1 65.62,2.83 65.8,2.65 | 58.96,34 63,34 67,38 v94,38
#CAN_RST
  Top 0.61: U3.4 13.24,71.09 15.57,73.42 U2.8
ALL_FLT
  Top 0.305: U6.20 32.65,23.36 31,25 31,32.7 30.25,33.45 23.55,33.45 22.4,34.6 22.4,37.54 PI.29
ALLROUND_IND
  Top 1.422: ALLROUND.C 70.05,11.76 R10.2
ALLROUND_LED
  Top 0.61: Q3.1 72.28,19.79 R11.2 70.13,20.32 68.5,21.95 56.05,21.95 arc45 55.88,21.88 48.54,14.54 arc-45 48.36,14.46 U6.2
ALLROUND_LED_LSD
  Top 1.422: ALL_RUN.2 69.97,8.8 R10.1 69.63,8.82 67.8,10.65 67.8,13.65 69.4,15.25 Q3.3
BATT_CURR
  Top 0.305: BATT_MON.3 26.26,8.74 24.89,10.11 24.89,12.45 20.37,16.97 U4.6
BATT_FLT  (via drill 0.6)
  Top 0.305: U6.21 33.52,22.09 v28.7,17.27
  Bottom 0.305: v28.7,17.27 28.7,13.72 27.43,12.45 27.43,10.92 28.8,9.55 BATT_MON.4
BOW_LEDS
  Top 0.61: Q1.1 66.12,20.11 R13.2 65.22,19.95 59.2,19.95 | Q2.1 59.2,19.95 | 59.2,19.95 R12.2 | 59.2,19.95 56.05,19.95 arc45 55.87,19.87 49.27,13.27 arc-45 49.09,13.2 U6.1
CAN_H
  Top 0.254: 14.46,80.01 14.46,77.21
  Top 0.61: 14.46,77.21 14.96,76.71 16.46,76.71 16.84,76.32 U2.7 | 14.46,80.01 14.46,80.11 R4.1 13.1,83.14 14.71,84.74 CAN.1
CAN_INT
  Top 0.305: PI.26 27.43,37.53 27.43,49.28 28.96,50.8 28.96,54.36 27.84,55.47 U1.12
CAN_L
  Top 0.254: R5.2 22.47,81.32 | 21.06,79.91 21.06,77.11
  Top 0.61: 22.47,81.32 21.06,79.91 | 21.06,77.11 20.66,76.71 18.66,76.71 18.11,76.16 U2.6 | R5.2 22.47,82.76 20.49,84.74 CAN.2
CAN_RST  (via drill 0.6)
  Top 0.305: PI.36 14.73,37.53 14.73,40.64 18.54,44.45 18.54,50.8 22.86,55.12 v22.86,59.44 25.24,61.82 U1.17 | R7.1 8.46,72.38 9.11,71.74 U3.2 10.38,71.74 10.74,71.37 v10.74,68.58
  Bottom 0.305: v10.74,68.58 19.88,59.44 v22.86,59.44
CAN_TERM
  Top 0.61: C5.1 15.91,81.46 | R4.2 R5.1 R6.2
  Top 0.813: 15.91,81.46 R4.2
CAN_VREF
  Top 0.61: U2.5 19.52,74.37 22.47,77.32 R6.1
CS  (via drill 0.6)
  Top 0.305: U1.16 28.1,60.55 v29.97,58.67 | PI.24 29.97,37.53 v29.97,49.53
  Bottom 0.305: v29.97,58.67 v29.97,49.53
GND  (via drill 0.6)
  Top 0.305: U5.3 5.98,18.02 | U4.1 14.77,18.97 14.45,18.65 14.45,18.25 14.73,17.97 U4.3
  other vias: 15.24,20.07 16,23.11
  pour Bottom: 0,0 104,0 104,90 0,90
  pour Top: 0,0 104,0 104,90 0,90
GPA6
  Top 0.61: U6.27 33.03,14.46 GPA6.TP
GPA7
  Top 0.61: U6.28 GPA7.TP
IO_RST
  Top 0.305: U6.18 33.1,25.89 32,27 32,33 31,34 26,34 24.9,35.1 24.9,40.1 24,41 20,41 18.57,39.57 PI.31
MISO  (via drill 0.6)
  Top 0.305: U1.15 28.1,59.28 v31.24,56.13 | v31.24,48.01 31.27,47.98 PI.21
  Bottom 0.305: v31.24,56.13 v31.24,48.01
MOSI
  Top 0.305: U1.14 27.84,58.01 30.48,55.37 30.48,50.55 33.78,47.24 33.78,38.86 PI.19
OSC1
  Top 0.61: U1.8 16.4,54.2 Y1.2 C6.1
OSC2
  Top 0.61: U1.7 16.53,55.47 Y1.1 14.56,62.24 C7.1
PORT_CURR
  Top 0.305: U4.5 15.65,5.95 M1M2CS.2
PORT_DIR
  Top 0.61: U6.4 43.01,17 42,16 42,12 43,11 45,11 45.86,10.14 M1M2DIR.2
PORT_FLT
  Top 0.61: U6.23 37.45,19.55 38,19 38,13 37,12 35,12 33.21,10.21 M1M2FLT.2
PORT_IND
  Top 1.422: PORT.C 57.09,11.78 R9.2
PORT_LED_LSD
  Top 1.422: PORT_RUN.2 57,8.75 R9.1 56.65,8.8 54.8,10.65 54.8,13.65 56.4,15.25 Q2.3
PORT_SLP
  Top 0.61: U6.6 41.55,19.55 40,18 40,11 39.56,10.56 M1M2SLP.2
RF_RX  (via drill 0.6)
  Top 0.305: MODEM.6 90.52,40.48 87,44 66.31,44 R1.1 65.39,44 v49,44
  Bottom 0.305: PI.10 47.8,37.58 47.8,42.8 v49,44
RF_SHDN  (via drill 0.6)
  Top 0.305: MODEM.7 88.52,29.52 87,28 v57,28
  Bottom 0.305: v57,28 51.97,33.03 45.46,33.03 43.97,34.52 PI.12
RF_TX  (via drill 0.6)
  Top 0.305: MODEM.5 90.18,30.22 89.55,30.85 89.55,40.45 87,43 v51,43
  Bottom 0.305: PI.8 50.35,37.59 50.35,42.35 v51,43
RXCAN
  Top 0.406: U1.2 19.32,61.82 20,62.5 20,65.5 19.5,66 19.5,68.65 U2.4
RXLED
  Top 0.305: MODEM.3 92.52,29.44 R3.1
RXLED_L
  Top 0.61: RX.A 89.98,24 R3.2
SCL  (via drill 0.6)
  Top 0.305: U5.10 11.35,20.35 v15,24 | U4.10 19.97,18.97 v21,20 | v33.34,24.24 34.4,25.3 38.5,25.3 40.37,27.16 U6.12 v47.16,27.16 | PI.5 50.83,38.83 50.35,38.35 v50.35,30.35
  Bottom 0.305: v15,24 21,24 | 21,24 26.3,24 LCD.4 RTC.4 v33.34,24.24 | v21,20 21,24 | v50.35,30.35 v47.16,27.16
SCLK
  Top 0.305: U1.13 27.84,56.74 29.72,54.86 29.72,50.55 28.7,49.53 28.7,38.86 PI.23
SDA  (via drill 0.6)
  Top 0.305: U5.9 12.12,18.52 13.4,19.8 13.4,21.4 14.3,22.3 24.85,22.3 25,22.45 | v33.62,26.78 33.9,26.5 38.4,26.5 40.34,28.43 U6.13 50.44,28.43 52.85,30.85 52.85,37.85 53.83,38.83 PI.3 | LCD.3 25.77,26.77 25,26 25,22.45 | U4.9 24.47,18.47 25,19 25,22.45
  Bottom 0.305: LCD.3 29,26.77 | 29,26.77 RTC.3 | v33.62,26.78 RTC.3 29.01,26.78 29,26.77
STAR_CURR
  Top 0.305: M1M2CS.1 16.76,5.36 16.76,17.02 16.31,17.47 U4.4
STAR_DIR
  Top 0.61: U6.3 43.73,15.73 43,15 43,13 44,12 46,12 47.86,10.14 M1M2DIR.1
STAR_FLT
  Top 0.61: U6.22 38.19,20.82 39,20 39,12 38,11 36,11 35.21,10.21 M1M2FLT.1
STAR_IND
  Top 1.422: STARBOARD.C 63.74,11.71 R8.2
STAR_SLP
  Top 0.61: U6.5 42.27,18.27 41,17 41,11 41.56,10.44 M1M2SLP.1
STARBOARD_LED_LSD
  Top 1.422: STAR_RUN.2 63.62,8.75 R8.1 | Q1.3 63.4,15.25 61.3,13.15 61.3,10.15 62.67,8.78 R8.1 | R8.1 63.65,8.8
SW_COM
  Top 0.61: U6.26 30.21,15.73 28.7,14.22 SWITCH.5
SW_LED
  Top 0.61: U6.25 29.96,17 26.16,13.21 SWITCH.4
TX_PWR
  Top 0.305: MODEM.4 92.83,34.52 93.5,33.85 R2.1
TX_PWR_L
  Top 0.61: R2.2 93.5,21.1 TX.C
TXCAN
  Top 0.406: U1.1 18.15,64.35 15.5,67 15.5,68.7 U2.1
VBATT
  Top 0.305: WINCH.8 10.14,4.61 arc-45 10.32,4.54 R14.1
VBATT_ADC
  Top 0.305: U5.4 8.48,17.52 9,17 9,13.46 arc45 9.07,13.28 13.02,9.33 arc45 13.2,9.26 | 10.98,6.94 R15.1
  Top 0.61: R14.2 arc-45 10.98,6.94 | R15.1 13.2,9.26
WINCH_CURR  (via drill 0.6)
  Top 0.305: U4.7 v24.57,17.47
  Bottom 0.305: 24.53,17.47 v24.57,17.47 20.56,13.46 6.6,13.46 2.9,9.76 WINCH.6
WINCH_DIR  (via drill 0.6)
  Top 0.305: U6.7 40.19,20.82 v40,21
  Bottom 0.305: v40,21 24,21 21,18 4.75,18 WINCH.2
WINCH_FLT  (via drill 0.6)
  Top 0.305: v31.27,18.27 U6.24
  Bottom 0.305: v31.27,18.27 23.27,18.27 19.22,14.22 6.35,14.22 4.36,12.23 WINCH.5
WINCH_PWM
  Top 0.305: WINCH.3 4.31,17.31 5.76,18.76 5.76,24.21 12.15,30.59 12.15,37.49 PI.35
WINCH_SLP  (via drill 0.6)
  Top 0.305: U6.8 43.09,22.09 v43,22
  Bottom 0.305: WINCH.4 18.77,14.77 24,20 41,20 v43,22

### Text on the board
Top: =^.^= / Moxie / Nano / Purple (RIP) / Lady Blue de Pouncealot / Sir Ciaran de Pouncealot / Sphinx / Nettle
tPlace: CAN H | CAN L | Swiftly cutting through the water, / Falling spray on either side, / Coyly dipping, / Rising, skipping, / Borne along by wind and tide, / Merrily my boat doth glide. / / --Dorothy Allen | 115200 8N1 | GND | MISO | MOSI | 3.3V | 3.3V | GND | WINCH / PWM | STAR / PWM | IO RST | ALL FLT | SCLK | GND | SCL | SDA | CAN / INT | CS | CAN / RST | GND | PORT / PWM | GND | GND | GND | SHDN | GND | 5V | 5V | RF RX | RF TX
bPlace: AutoBuoy Mainboard Rev. 1 / / https://github.com/agmlego/CreekFleet_AutoBuoy
tNames: XT09-SI / 900MHz Radio Modem | 5V | RF RX | TX/PWR | GND | 3.3V | SHDN | RF TX | RX | GND | SDA | SCL | GND | 0x78 | 0x68 | DIR | PWM | 0x49 | 0x48 | SLP | GND | GND | 3.3V | SW / LED | SW / COM | FLT | 0x20 | CURR | GND | 3.3V | 3.3V | PORT CURR | STAR / CURR | BATT / CURR | BATT / FLT | PORT FLT | STAR FLT | PORT SLP | STAR SLP | PORT DIR | STAR DIR | - | + | - | + | - | + | VBATT